# EAGLE design node-lite (EAGLE 8.3.2)
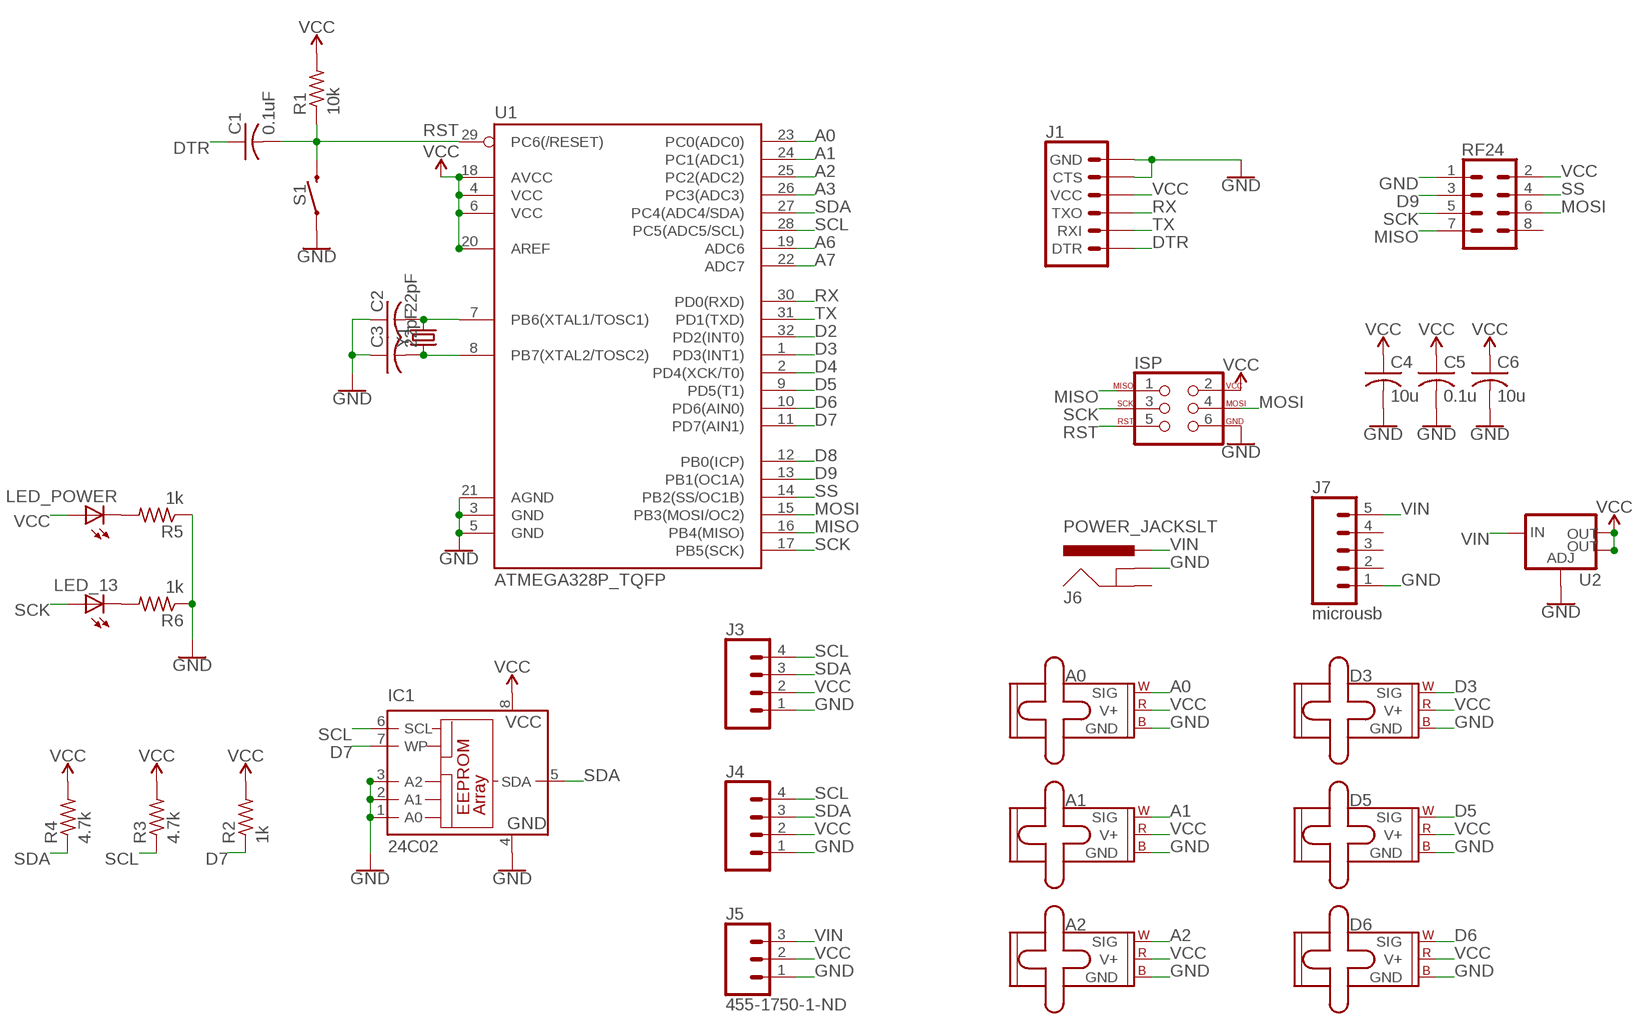
[diagram p0: schematic, sheet 1]

## Parts
A0  SERVO  [1X03]
A1  SERVO  [1X03]
A2  SERVO  [1X03]
C1  0.1uF  C-USC1206  [C1206]
C2  22pF  C-USC1206  [C1206]
C3  22pF  C-USC1206  [C1206]
C4  10u  C-USC1206  [C1206]
C5  0.1u  C-USC1206  [C1206]
C6  10u  C-USC1206  [C1206]
D3  SERVO  [1X03]
D5  SERVO  [1X03]
D6  SERVO  [1X03]
IC1  24C02  24C02ASN  [SO-08]
ISP  AVR_SPI_PROG_3X2NS  [2X3-NS]
J1  6_PIN_SERIAL_TARGET  [1X06]
J3  CONN_04  [1X04]
J4  CONN_04  [1X04]
J5  455-1750-1-ND  CONN_03  [1X03]
J6  POWER_JACKSLT  [POWER_JACK_SLOT]
J7  microusb  CONN_05  [1X05]
LED_13  LEDCHIPLED_1206  [CHIPLED_1206]
LED_POWER  LEDCHIPLED_1206  [CHIPLED_1206]
R1  10k  R-US_R1206  [R1206]
R2  1k  R-US_R1206  [R1206]
R3  4.7k  R-US_R1206  [R1206]
R4  4.7k  R-US_R1206  [R1206]
R5  1k  R-US_R1206  [R1206]
R6  1k  R-US_R1206  [R1206]
RF24  CONN_04X2  [2X4]
S1  MOMENTARY-SWITCH-SPST-PTH-6.0MM  [TACTILE_SWITCH_PTH_6.0MM]
U1  ATMEGA328P_TQFP  [TQFP32-08]
U2  V_REG_LM1117SOT223  [SOT223]
Y1  CRYSTALPTH-HC49US  [HC49US]

## Nets
A0: A0.1(SIG) U1.23(PC0(ADC0))
A1: A1.1(SIG) U1.24(PC1(ADC1))
A2: A2.1(SIG) U1.25(PC2(ADC2))
A3: U1.26(PC3(ADC3))
A6: U1.19(ADC6)
A7: U1.22(ADC7)
D2: U1.32(PD2(INT0))
D3: D3.1(SIG) U1.1(PD3(INT1))
D4: U1.2(PD4(XCK/T0))
D5: D5.1(SIG) U1.9(PD5(T1))
D6: D6.1(SIG) U1.10(PD6(AIN0))
D7: IC1.7(WP) R2.1 U1.11(PD7(AIN1))
D8: U1.12(PB0(ICP))
D9: RF24.3 U1.13(PB1(OC1A))
DTR: C1.1 J1.1(DTR)
GND: A0.3(GND) A1.3(GND) A2.3(GND) C2.1 C3.1 C4.2 C5.2 C6.2 D3.3(GND) D5.3(GND) D6.3(GND) IC1.1(A0) IC1.2(A1) IC1.3(A2) IC1.4(GND) ISP.6 J1.5(CTS) J1.6(GND) J3.1 J4.1 J5.1 J6.GND@1(GNDBREAK) J7.1 R5.1 R6.1 RF24.1 S1.1 U1.3(GND) U1.5(GND) U1.21(AGND) U2.1(ADJ)
MISO: ISP.1 RF24.7 U1.16(PB4(MISO))
MOSI: ISP.4 RF24.6 U1.15(PB3(MOSI/OC2))
N$1: C2.2 U1.7(PB6(XTAL1/TOSC1)) Y1.2
N$2: C3.2 U1.8(PB7(XTAL2/TOSC2)) Y1.1
N$4: LED_POWER.C R5.2
N$5: LED_13.C R6.2
RST: C1.2 ISP.5 R1.1 S1.3 U1.29(PC6(/RESET))
RX: J1.3(TXO) U1.30(PD0(RXD))
SCK: ISP.3 LED_13.A RF24.5 U1.17(PB5(SCK))
SCL: IC1.6(SCL) J3.4 J4.4 R3.1 U1.28(PC5(ADC5/SCL))
SDA: IC1.5(SDA) J3.3 J4.3 R4.1 U1.27(PC4(ADC4/SDA))
SS: RF24.4 U1.14(PB2(SS/OC1B))
TX: J1.2(RXI) U1.31(PD1(TXD))
VCC: A0.2(V+) A1.2(V+) A2.2(V+) C4.1 C5.1 C6.1 D3.2(V+) D5.2(V+) D6.2(V+) IC1.8(VCC) ISP.2 J1.4(VCC) J3.2 J4.2 J5.2 LED_POWER.A R1.2 R2.2 R3.2 R4.2 RF24.2 U1.4(VCC) U1.6(VCC) U1.18(AVCC) U1.20(AREF) U2.2(OUT) U2.4(OUT)
VIN: J5.3 J6.PWR J7.5 U2.3(IN)
Unconnected: J6.GND@2(GND) J7.2 J7.3 J7.4 RF24.8

## Library data of the parts
A0 A1 A2 D3 D5 D6 = SparkFun-Electromechanical:SERVO: Servo Motor 3-pin connector for a standard servo motor (voltage supply, ground, and control signal.) SparkFun Products Servo - Generic (Sub-Micro Size) <https://www.sparkfun.com/products/9065> (ROB-09065) Servo - Generic High Torque Continuous Rotation (Standard Size) <https://www.sparkfun.com/products/9347> (ROB-09347) Servo - Generic High Torque (Standard Size) <https://www.sparkfun.com/products/11965> (ROB-11965)
C1-C6 = resistor:C-US: CAPACITOR, American symbol
IC1 = microchip:24C*: Serial EEPROM 1 K/2 K/4 K; OC_FARNELL: unknown; OC_NEWARK: unknown
ISP = SparkFun-Connectors:AVR_SPI_PROG_3X2: AVR ISP 6 Pin This is the reduced ISP connector for AVR programming. Common on Arduino. This footprint will take up less PCB space and can be used with a 10-pin to 6-pin adapter such as SKU: BOB-08508 **Special note about "TEST_POINT" package. The stop mask is on the top side, so if you want your programming test points to be on the bottom of your board, make sure to place this package on the bottom side of the board. This also ensure that the orientation to program from the bottom side will be correct. SparkFun Products: SparkFun ISP Pogo Adapter <https://www.sparkfun.com/products/11591> - NS Tiny AVR Programmer <https://www.sparkfun.com/products/11801> -PTH
J1 = SparkFun-Connectors:6_PIN_SERIAL_TARGET: 6-pin header connection for use with the "FTDI BASIC" pinout - TARGET SIDE. Also known as "Arduino Serial Program Header". It is used to mate with our FTDI Basic serial programmers using the Arduino IDE. Note, this device has "TARGET" in the name. It is intended to be used on a design that contains a target micro-controller that you wish to program. The "sister" device, named "CABLE" is inteneded to be used on a design that usually lives on the end of your USB cable and prvides the converter chip (FTDI232 or FTDI231x) to commnicate serial RX/TX. You can populate with some of these: Break Away Headers - Straight <https://www.sparkfun.com/products/116> (PRT-00116) For reference (or to suit your programming needs) check out these designs: SparkFun FTDI Basic Breakout - 5V <https://www.sparkfun.com/products/9716> (DEV-09716) SparkFun FTDI Basic Breakout - 3.3V <https://www.sparkfun.com/products/9873> (DEV-09873) SparkFun FTDI SmartBasic <https://www.sparkfun.com/products/12935> (DEV-12935) SparkFun Beefy 3 - FTDI Basic Breakout <https://www.sparkfun.com/products/13746> (DEV-13746)
J3 J4 = SparkFun-Connectors:CONN_04: Multi connection point. Often used as Generic Header-pin footprint for 0.1 inch spaced/style header connections On any of the 0.1 inch spaced packages, you can populate with these: Break Away Headers - Straight <https://www.sparkfun.com/products/116> (PRT-00116) Break Away Male Headers - Right Angle <https://www.sparkfun.com/products/553> (PRT-00553) Female Headers <https://www.sparkfun.com/products/115> (PRT-00115) Break Away Headers - Machine Pin <https://www.sparkfun.com/products/117> (PRT-00117) Break Away Female Headers - Swiss Machine Pin <https://www.sparkfun.com/products/743> (PRT-00743) For SCREWTERMINALS and SPRING TERMINALS visit here: Screw Terimnals on SparkFun.com <https://www.sparkfun.com/search/results?term=Screw+Terminals> (5mm/3.5mm/2.54mm spacing) This device is also useful as a general connection point to wire up your design to another part of your project. Our various solder wires solder well into these plated through hole pads. Hook-Up Wire - Assortment (Stranded, 22 AWG) <https://www.sparkfun.com/products/11375> (PRT-11375) Hook-Up Wire - Assortment (Solid Core, 22 AWG) <https://www.sparkfun.com/products/11367> (PRT-11367) View the entire wire category on our website here <https://www.sparkfun.com/categories/141> Special notes: Molex polarized connector foot print use with SKU : PRT-08231 with associated crimp pins and housings. 1MM SMD Version SKU: PRT-10208; PROD_ID: CONN-09696
J5 = SparkFun-Connectors:CONN_03: Multi connection point. Often used as Generic Header-pin footprint for 0.1 inch spaced/style header connections On any of the 0.1 inch spaced packages, you can populate with these: Break Away Headers - Straight <https://www.sparkfun.com/products/116> (PRT-00116) Break Away Male Headers - Right Angle <https://www.sparkfun.com/products/553> (PRT-00553) Female Headers <https://www.sparkfun.com/products/115> (PRT-00115) Break Away Headers - Machine Pin <https://www.sparkfun.com/products/117> (PRT-00117) Break Away Female Headers - Swiss Machine Pin <https://www.sparkfun.com/products/743> (PRT-00743) Stackable Header - 3 Pin (Female, 0.1") <https://www.sparkfun.com/products/13875> (PRT-13875) For SCREWTERMINALS and SPRING TERMINALS visit here: Screw Terimnals on SparkFun.com <https://www.sparkfun.com/search/results?term=Screw+Terminals> (5mm/3.5mm/2.54mm spacing) This device is also useful as a general connection point to wire up your design to another part of your project. Our various solder wires solder well into these plated through hole pads. Hook-Up Wire - Assortment (Stranded, 22 AWG) <https://www.sparkfun.com/products/11375> (PRT-11375) Hook-Up Wire - Assortment (Solid Core, 22 AWG) <https://www.sparkfun.com/products/11367> (PRT-11367) View the entire wire category on our website here <https://www.sparkfun.com/categories/141> Special notes: Molex polarized connector foot print use with SKU : PRT-08232 with associated crimp pins and housings.; PROD_ID: XXX-00000
J6 = SparkFun-Connectors:POWER_JACK: Power Jack Connector This is the standard 5.5mm barrel jack for power. The PTH is the most common, proven, reliable, footprint. The Slot footprint only works if the mill layer is transmitted to the PCB fab house so be warned. Here are the connectors we sell at SparkFun: DC Barrel Power Jack/Connector <https://www.sparkfun.com/products/119> (PRT-00119) DC Barrel Power Jack/Connector (SMD) <https://www.sparkfun.com/products/12748> (PRT-12748) DC Barrel Jack Adapter - Breadboard Compatible <https://www.sparkfun.com/products/10811> (PRT-10811) It is used on this SparkFun product (and many, many others): SparkFun RedBoard - Programmed with Arduino <https://www.sparkfun.com/products/12757> (DEV-12757) Also, if you need a mating power supply or connector, please check these out: Wall Adapter Power Supply - 9VDC 650mA <https://www.sparkfun.com/products/298> (TOL-00298) DC Barrel Jack Adapter - Male <https://www.sparkfun.com/products/10287> (PRT-10287); PROD_ID: PRT-00119
J7 = SparkFun-Connectors:CONN_05: Multi connection point. Often used as Generic Header-pin footprint for 0.1 inch spaced/style header connections On any of the 0.1 inch spaced packages, you can populate with these: Break Away Headers - Straight <https://www.sparkfun.com/products/116> (PRT-00116) Break Away Male Headers - Right Angle <https://www.sparkfun.com/products/553> (PRT-00553) Female Headers <https://www.sparkfun.com/products/115> (PRT-00115) Break Away Headers - Machine Pin <https://www.sparkfun.com/products/117> (PRT-00117) Break Away Female Headers - Swiss Machine Pin <https://www.sparkfun.com/products/743> (PRT-00743) For SCREWTERMINALS and SPRING TERMINALS visit here: Screw Terimnals on SparkFun.com <https://www.sparkfun.com/search/results?term=Screw+Terminals> (5mm/3.5mm/2.54mm spacing) This device is also useful as a general connection point to wire up your design to another part of your project. Our various solder wires solder well into these plated through hole pads. Hook-Up Wire - Assortment (Stranded, 22 AWG) <https://www.sparkfun.com/products/11375> (PRT-11375) Hook-Up Wire - Assortment (Solid Core, 22 AWG) <https://www.sparkfun.com/products/11367> (PRT-11367) View the entire wire category on our website here <https://www.sparkfun.com/categories/141> Special notes: Molex polarized connector foot print use with SKU : PRT-08231 with associated crimp pins and housings. 1MM SMD Version SKU: PRT-10208
LED_13 LED_POWER = adafruit:LED: LED OSRAM: - CHIPLED LG R971, LG N971, LY N971, LG Q971, LY Q971, LO R971, LY R971 LH N974, LH R974 LS Q976, LO Q976, LY Q976 LO Q996 - Hyper CHIPLED LW Q18S LB Q993, LB Q99A, LB R99A - SideLED LS A670, LO A670, LY A670, LG A670, LP A670 LB A673, LV A673, LT A673, LW A673 LH A674 LY A675 LS A676, LA A676, LO A676, LY A676, LW A676 LS A679, LY A679, LG A679 - Hyper Micro SIDELED® LS Y876, LA Y876, LO Y876, LY Y876 LT Y87S - SmartLED LW L88C, LW L88S LB L89C, LB L89S, LG L890 LS L89K, LO L89K, LY L89K LS L896, LA L896, LO L896, LY L896 - TOPLED LS T670, LO T670, LY T670, LG T670, LP T670 LSG T670, LSP T670, LSY T670, LOP T670, LYG T670 LG T671, LOG T671, LSG T671 LB T673, LV T673, LT T673, LW T673 LH T674 LS T676, LA T676, LO T676, LY T676, LB T676, LH T676, LSB T676, LW T676 LB T67C, LV T67C, LT T67C, LS T67K, LO T67K, LY T67K, LW E67C LS E67B, LA E67B, LO E67B, LY E67B, LB E67C, LV E67C, LT E67C LW T67C LS T679, LY T679, LG T679 LS T770, LO T770, LY T770, LG T770, LP T770 LB T773, LV T773, LT T773, LW T773 LH T774 LS E675, LA E675, LY E675, LS T675 LS T776, LA T776, LO T776, LY T776, LB T776 LHGB T686 LT T68C, LB T68C - Hyper Mini TOPLED® LB M676 - Mini TOPLED Santana® LG M470 LS M47K, LO M47K, LY M47K Source: http://www.osram.convergy.de/
R1-R6 = resistor:R-US_: RESISTOR, American symbol
RF24 = SparkFun-Connectors:CONN_04X2: Multi connection point. Often used as Generic Header-pin footprint for 0.1 inch spaced/style header connections On any of the 0.1 inch spaced packages, you can populate with these: Break Away Headers - Straight <https://www.sparkfun.com/products/116> (PRT-00116) Break Away Male Headers - Right Angle <https://www.sparkfun.com/products/553> (PRT-00553) Female Headers <https://www.sparkfun.com/products/115> (PRT-00115) Break Away Headers - Machine Pin <https://www.sparkfun.com/products/117> (PRT-00117) Break Away Female Headers - Swiss Machine Pin <https://www.sparkfun.com/products/743> (PRT-00743)
S1 = SparkFun-Switches:MOMENTARY-SWITCH-SPST: Momentary Switch (Pushbutton) - SPST Normally-open (NO) SPST momentary switches (buttons, pushbuttons). Variants PTH-12MM - 12mm square, through-hole Momentary Pushbutton Switch - 12mm Square <https://www.sparkfun.com/products/9190> (COM-09190) PTH-6.0MM, PTH-6.0MM-KIT - 6.0mm square, through-hole Mini Pushbutton Switch <https://www.sparkfun.com/products/97> (COM-00097) KIT package intended for soldering kit's - only one side of pads' copper is exposed. PTH-RIGHT-ANGLE-KIT - Right-angle, through-hole Right Angle Tactile Button <https://www.sparkfun.com/products/10791> - Used on SparkFun BigTime Watch Kit <https://www.sparkfun.com/products/11734> SMD-12MM - 12mm square, surface-mount Tactile Button - SMD (12mm) <https://www.sparkfun.com/products/12993> (COM-12993) Used on SparkFun PicoBoard <https://www.sparkfun.com/products/11888> SMD-4.5MM - 4.5mm Square Trackball Switch Used on SparkFun Blackberry Trackballer Breakout <https://www.sparkfun.com/products/13169> SMD-4.6MMX2.8MM - 4.60mm x 2.80mm, surface mount Used on SparkFun SAMD21 Mini Breakout <https://www.sparkfun.com/products/13664> SMD-5.2MM, SMD-5.2-REDUNDANT - 5.2mm square, surface-mount Mini Pushbutton Switch - SMD <https://www.sparkfun.com/products/8720> (COM-08720) Used on Arduino Pro Mini <https://www.sparkfun.com/products/11114> REDUNDANT package connects both switch circuits together SMD-6.0X3.5MM - 6.0 x 3.5mm, surface mount Momentary Reset Switch SMD <https://www.sparkfun.com/products/8229> (COM-08229) SMD-6.2MM-TALL - 6.2mm square, surface mount Tactile Button - SMD (6mm) <https://www.sparkfun.com/products/12992> Used on SparkFun Digital Sandbox <https://www.sparkfun.com/products/12651> SMD-RIGHT-ANGLE - Right-angle, surface mount Used on SparkFun Block for Intel® Edison - Arduino <https://www.sparkfun.com/products/13036>; PROD_ID: SWCH-08441; SF_SKU: COM-00097
U1 = SparkFun-IC-Microcontroller:ATMEGA328P_TQFP: Popular 328P in QFP Storefront component: ATmega328 - TQFP <https://www.sparkfun.com/products/13448> (COM-13448) Datasheet <http://www.sparkfun.com/datasheets/Components/SMD/ATMega328.pdf> SparkFun Products SparkFun RedBoard - Programmed with Arduino <https://www.sparkfun.com/products/12757> (DEV-12757) Arduino Pro Mini 328 - 5V/16MHz <https://www.sparkfun.com/products/11113> (DEV-11113) Arduino Pro Mini 328 - 3.3V/8MHz <https://www.sparkfun.com/products/11114> (DEV-11114) SparkFun OpenLog <https://www.sparkfun.com/products/13712> (DEV-13712) SparkFun MicroView - OLED Arduino Module <https://www.sparkfun.com/products/12923> (DEV-12923) SparkFun Digital Sandbox <https://www.sparkfun.com/products/12651> (DEV-12651) SparkFun PicoBoard <https://www.sparkfun.com/products/11888> (WIG-11888) Arduino Fio <https://www.sparkfun.com/products/10116> (DEV-10116) LilyPad Arduino 328 Main Board <https://www.sparkfun.com/products/13342> (DEV-13342) SparkFun RedStick <https://www.sparkfun.com/products/13741> (DEV-13741) LilyPad MP3 <https://www.sparkfun.com/products/11013> (DEV-11013) LilyPad Arduino SimpleSnap <https://www.sparkfun.com/products/10941> (DEV-10941) SparkFun Stepoko <https://www.sparkfun.com/products/13899> (ROB-13899) SparkFun Geiger Counter <https://www.sparkfun.com/products/11345> (SEN-11345) SparkFun EL Sequencer <https://www.sparkfun.com/products/12781> (COM-12781) Arduino Pro 328 - 5V/16MHz <https://www.sparkfun.com/products/10915> (DEV-10915) CryptoCape <https://www.sparkfun.com/products/12773> (DEV-12773) SparkFun IR Thermometer Evaluation Board - MLX90614 <https://www.sparkfun.com/products/10740> (SEN-10740) SparkFun RedBot Mainboard <https://www.sparkfun.com/products/12097> (ROB-12097) Arduino Pro 328 - 3.3V/8MHz <https://www.sparkfun.com/products/10914> (DEV-10914) SparkFun Block for Intel® Edison - Arduino <https://www.sparkfun.com/products/13036> (DEV-13036) SparkFun Simon Says - Surface Mount Soldering Kit <https://www.sparkfun.com/products/10935> (KIT-10935) SparkFun 7-Segment Serial Display - Red <https://www.sparkfun.com/products/11441> (COM-11441) SparkFun 7-Segment Serial Display - White <https://www.sparkfun.com/products/11629> (COM-11629) SparkFun 7-Segment Serial Display - Yellow <https://www.sparkfun.com/products/11443> (COM-11443) SparkFun 7-Segment Serial Display - Kelly Green <https://www.sparkfun.com/products/11440> (COM-11440) SparkFun 7-Segment Serial Display - Blue <https://www.sparkfun.com/products/11442> (COM-11442) SparkFun OpenSegment Serial Display - 20mm (Blue) <https://www.sparkfun.com/products/11647> (COM-11647) SparkFun OpenSegment Serial Display - 20mm (Green) <https://www.sparkfun.com/products/11646> (COM-11646) SparkFun OpenSegment Serial Display - 20mm (White) <https://www.sparkfun.com/products/11648> (COM-11648) SparkFun OpenSegment Serial Display - 20mm (Red) <https://www.sparkfun.com/products/11644> (COM-11644) SparkFun OpenSegment Serial Display - 20mm (Yellow) <https://www.sparkfun.com/products/11645> (COM-11645) SparkFun OpenSegment Shield <https://www.sparkfun.com/products/13190> (DEV-13190); PROD_ID: IC-09069
U2 = SparkFun-IC-Power:V_REG_LM1117: Voltage Regulator LM1117 Standard adjustable voltage regulator but in SMD form. Spark Fun Electronics SKU : COM-00595; PROD_ID: VREG-08170
Y1 = SparkFun-Clocks:CRYSTAL: Crystals (Generic) These are passive quartz crystals, which can be used as a clock source for a microcontroller. Crystal's are two-terminal devices. They require external "load" capacitors to generate an oscillating signal.

## Board
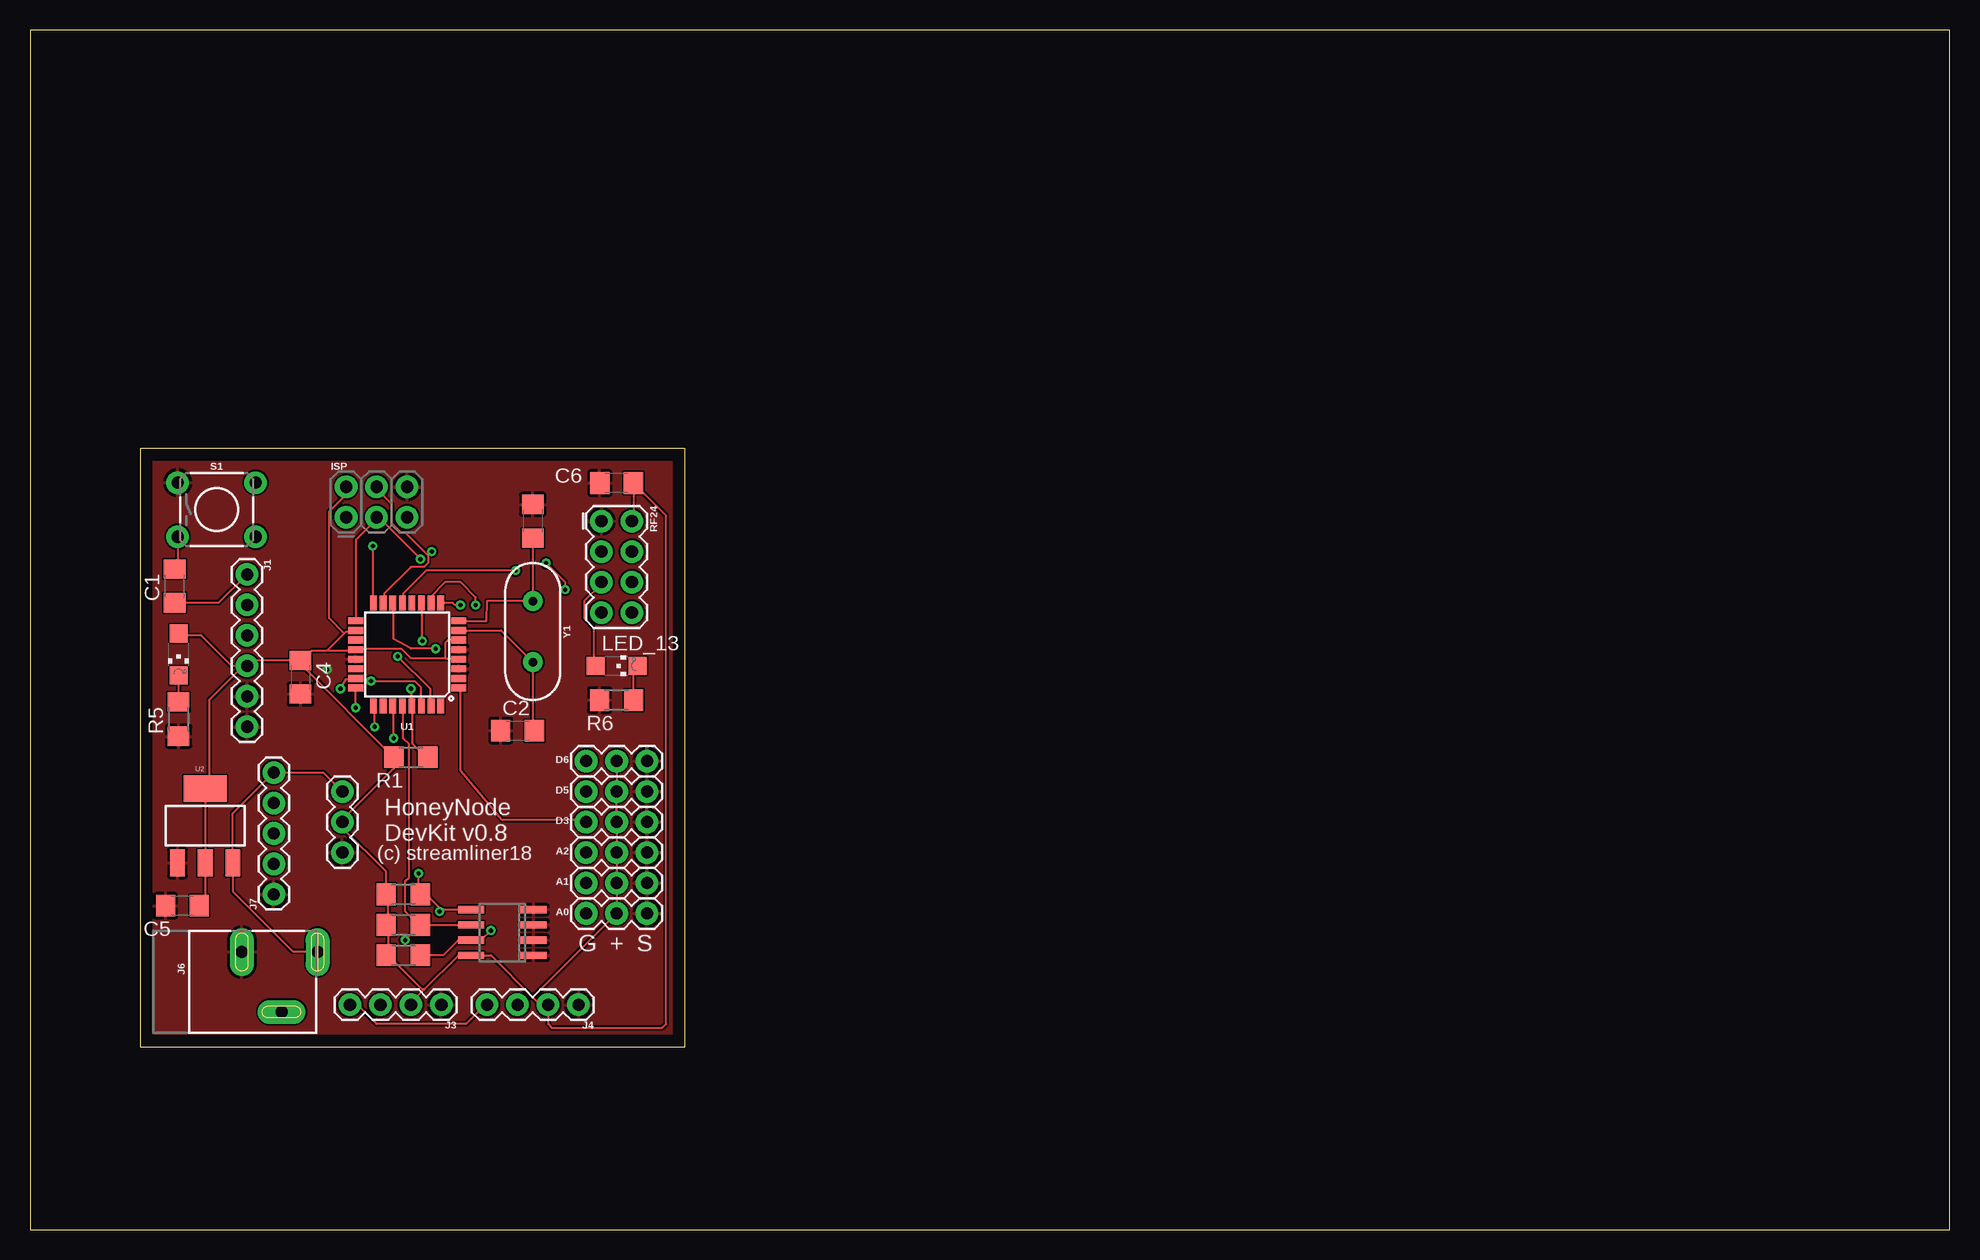
[diagram p1: board, top side]
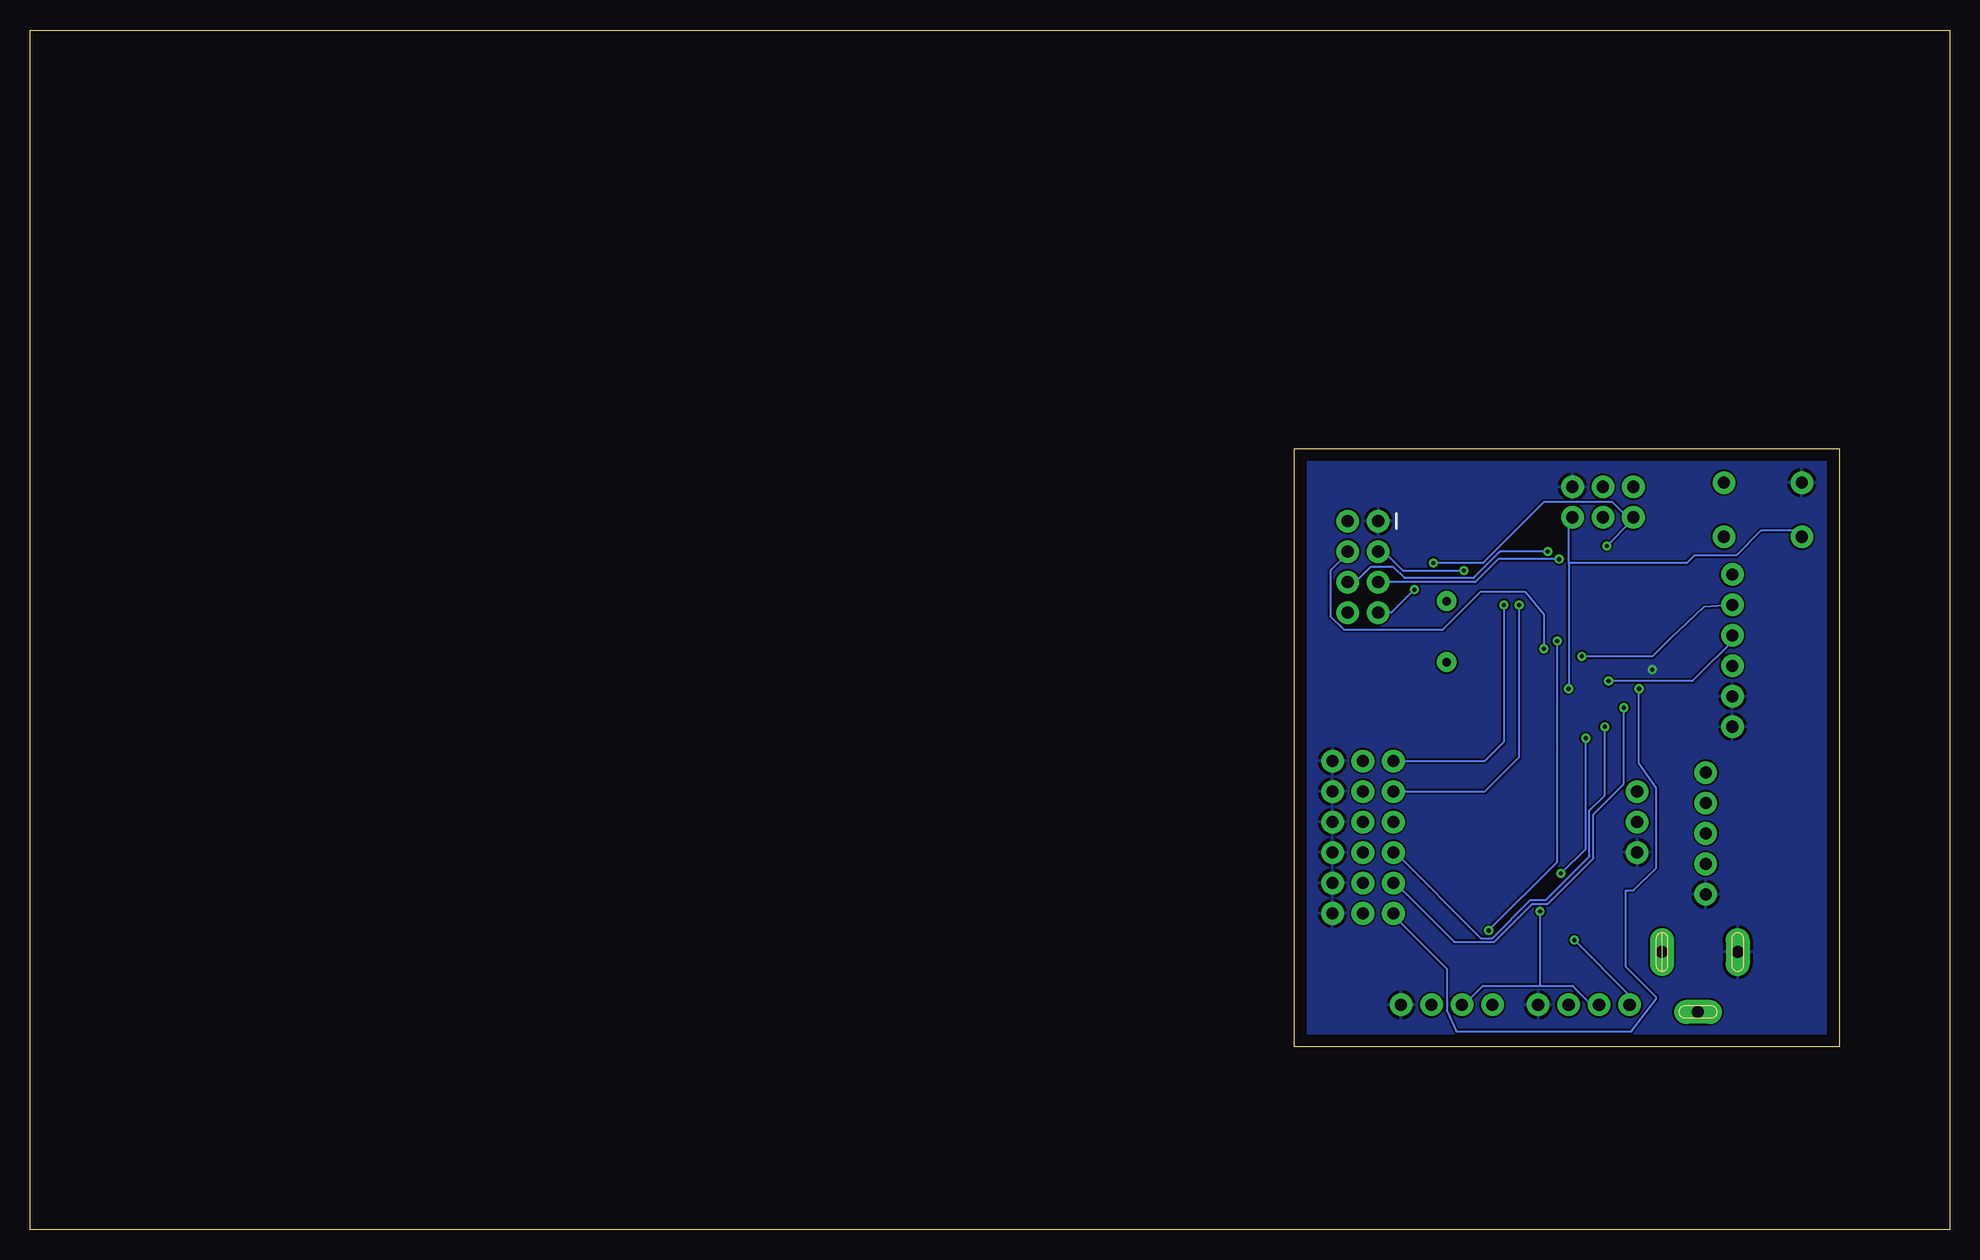
[diagram p2: board, bottom side, seen from below]

Size 160 x 100 mm. Coordinates in mm from the lower left corner, seen from the top.
Outline: 0,0 160,0 160,100 0,100 0,0
Outline: 9.21,65.09 9.21,15.24 54.61,15.24 54.61,65.09 9.21,65.09
Copper layers (1*16): Top 0.035mm / dielectric 1.5mm / Bottom 0.035mm
Design rules "default": minimum track width 6mil, minimum drill 0.35mm, track to track 6mil, track to pad 6mil, pad to pad 6mil, via to via 6mil, smd to smd 6mil, copper to edge 40mil, drill to drill 6mil, minimum pad ring 10mil, minimum via ring 8mil, stop-mask expansion 4mil, vias tented up to drill 0mil, thermal gap 10mil

### Footprints (pad centres in the part's own frame; a part is rotated, then mirrored left to right if it is on the bottom)
1X03 = drill 1.016 pad 1.88: 1 0,0; 2 2.54,0; 3 5.08,0
C1206 = smd 1.6 x 1.8: 1 -1.4,0; 2 1.4,0
SO-08 = smd 0.6 x 2.2: 1 -1.905,-2.6; 2 -0.635,-2.6; 3 0.635,-2.6; 4 1.905,-2.6; 5 1.905,2.6; 6 0.635,2.6; 7 -0.635,2.6; 8 -1.905,2.6
2X3-NS = drill 1.016 pad 1.88: 1 -2.54,-1.27; 2 -2.54,1.27; 3 0,-1.27; 4 0,1.27; 5 2.54,-1.27; 6 2.54,1.27
1X06 = drill 1.016 pad 1.88: 1 0,0; 2 2.54,0; 3 5.08,0; 4 7.62,0; 5 10.16,0; 6 12.7,0
1X04 = drill 1.016 pad 1.88: 1 0,0; 2 2.54,0; 3 5.08,0; 4 7.62,0
POWER_JACK_SLOT = drill 1 pad 2 long: GND@1 2.58,7.5; GND@2 7.58,10.8; PWR 2.58,13.8
1X05 = drill 1.016 pad 1.88: 1 0,0; 2 2.54,0; 3 5.08,0; 4 7.62,0; 5 10.16,0
CHIPLED_1206 = smd 1.5 x 1.5: A 0,-1.75; C 0,1.75
R1206 = smd 1.6 x 1.803: 1 -1.422,0; 2 1.422,0
2X4 = drill 1.016 pad 1.88: 1 -3.81,-1.27; 2 -3.81,1.27; 3 -1.27,-1.27; 4 -1.27,1.27; 5 1.27,-1.27; 6 1.27,1.27; 7 3.81,-1.27; 8 3.81,1.27
TACTILE_SWITCH_PTH_6.0MM = drill 1.016 pad 1.88: 1 -3.251,2.261; 2 3.251,2.261; 3 -3.251,-2.261; 4 3.251,-2.261
TQFP32-08 = smd 1.27 x 0.559: 1 -4.293,2.8; 2 -4.293,2; 3 -4.293,1.2; 4 -4.293,0.4; 5 -4.293,-0.4; 6 -4.293,-1.2; 7 -4.293,-2; 8 -4.293,-2.8; 17 4.293,-2.8; 18 4.293,-2; 19 4.293,-1.2; 20 4.293,-0.4; 21 4.293,0.4; 22 4.293,1.2; 23 4.293,2; 24 4.293,2.8 | smd 0.559 x 1.27: 9 -2.8,-4.293; 10 -2,-4.293; 11 -1.2,-4.293; 12 -0.4,-4.293; 13 0.4,-4.293; 14 1.2,-4.293; 15 2,-4.293; 16 2.8,-4.293; 25 2.8,4.293; 26 2,4.293; 27 1.2,4.293; 28 0.4,4.293; 29 -0.4,4.293; 30 -1.2,4.293; 31 -2,4.293; 32 -2.8,4.293
SOT223 = smd 1.219 x 2.235: 1 -2.311,-3.099; 2 0,-3.099; 3 2.311,-3.099 | smd 3.6 x 2.2: 4 0,3.099
HC49US = drill 0.7 pad 1.651: 1 -2.54,0; 2 2.54,0

### Placement (x,y rotation side)
A0  46.35,26.35 0 top
A1  46.35,28.89 0 top
A2  46.35,31.43 0 top
C1  12.06,53.66 90 top
C2  40.64,41.59 0 top
C3  41.91,59.05 270 top
C4  22.54,46.04 270 top
C5  12.7,26.99 180 top
C6  48.9,62.23 180 top
D3  46.35,33.97 0 top
D5  46.35,36.51 0 top
D6  46.35,39.05 0 top
IC1  39.37,24.77 90 top
ISP  28.89,60.64 0 top
J1  18.1,54.61 270 top
J3  34.29,18.73 180 top
J4  45.72,18.73 180 top
J5  26.04,31.43 90 top
J6  10.16,25.72 270 top
J7  20.32,27.94 90 top
LED_13  48.9,46.99 270 top
LED_POWER  12.38,47.94 180 top
R1  31.75,39.37 180 top
R2  31.11,22.86 180 top
R3  31.11,25.4 180 top
R4  31.11,27.94 180 top
R5  12.38,42.55 90 top
R6  48.9,44.13 0 top
RF24  48.9,55.24 270 top
S1  15.56,60.01 0 top
U1  31.43,47.94 180 top
U2  14.61,33.66 0 top
Y1  41.91,49.85 270 top

### Tracks (layer width: path | path; a pad name or v marks a point on that pad's centre or on a via)
A0  (via drill 0.35)
  Top 0.152: v25.88,45.09 26.35,45.88 26.99,45.88 U1.23
  Bottom 0.152: v25.88,45.09 25.88,38.89 24.45,36.83 24.45,30.16 26.35,28.26 26.99,28.26 26.99,21.91 24.45,19.37 24.45,19.21 26.51,16.51 41.12,16.51 41.91,18.26 41.91,21.75 46.35,26.19 A0.1
A1  (via drill 0.35)
  Top 0.152: v27.15,43.5 27.15,45.09 U1.24
  Bottom 0.152: v27.15,43.5 27.15,37.15 29.69,34.61 29.69,30.96 33.5,27.15 34.77,27.15 37.94,23.97 41.27,23.97 46.2,28.89 A1.1
A2  (via drill 0.35)
  Top 0.152: v28.73,41.91 28.73,43.5 U1.25
  Bottom 0.152: v28.73,41.91 28.73,36.2 30,34.92 30,31.11 33.66,27.46 34.92,27.46 38.1,24.29 39.05,24.29 46.2,31.43 A2.1
D3
  Top 0.152: D3.1 46.2,34.13 39.37,34.13 35.88,38.26 35.88,45.09 U1.1
D5  (via drill 0.35)
  Top 0.152: 35.24,52.23 U1.9 | 35.24,52.23 35.27,52.23 | v35.88,52.07 35.41,52.07 35.24,52.23
  Bottom 0.152: v35.88,52.07 35.88,39.37 38.73,36.51 D5.1
D6  (via drill 0.35)
  Top 0.152: v37.15,52.07 37.15,52.7 35.88,53.98 34.61,53.98 33.34,52.7 33.34,52.33 U1.10
  Bottom 0.152: v37.15,52.07 37.15,40.64 38.73,39.05 D6.1
D7  (via drill 0.35)
  Top 0.152: v32.7,49.05 32.7,52.23 U1.11 | v38.42,24.92 37.62,24.13 IC1.7 35.72,24.13 34.45,22.86 R2.1
  Bottom 0.152: v32.7,49.05 32.7,30.64 v38.42,24.92
D9  (via drill 0.35)
  Top 0.152: v40.48,54.93 33.02,54.93 31.11,53.02 31.11,52.39 U1.13
  Bottom 0.152: v40.48,54.93 45.56,54.93 47.15,56.52 RF24.3
DTR
  Top 0.152: C1.1 15.74,52.26 J1.1
GND  (via drill 0.35)
  other vias: 24.77,46.67
  pour Top: 6.35,13.97 6.35,68.58 57.15,68.58 57.15,13.97
  pour Bottom: 3.81,71.12 3.81,11.43 59.69,11.43 59.69,71.12
MISO  (via drill 0.35)
  Top 0.152: v28.57,56.99 28.57,52.39 U1.16 | v44.61,53.34 44.61,53.98 v43.02,55.56
  Bottom 0.152: 26.51,59.05 26.35,59.21 ISP.1 26.51,59.05 | 26.51,59.05 v28.57,56.99 | RF24.7 46.51,51.44 v44.61,53.34 | v43.02,55.56 38.89,55.56 33.81,60.64 28.1,60.64 26.51,59.05
MOSI  (via drill 0.35)
  Top 0.152: 33.18,56.2 33.18,55.56 32.86,55.24 31.75,55.24 29.53,53.02 29.53,52.39 U1.15 | 33.18,56.2 31.27,58.1 30.96,58.1 30.16,58.9 30.16,60.48 28.89,61.75 ISP.4 | 33.18,56.2 v33.5,56.52
  Bottom 0.152: RF24.6 49.53,53.98 48.26,55.24 46.35,55.24 45.4,54.29 39.69,54.29 37.47,56.52 v33.5,56.52
N$1
  Top 0.152: C2.2 41.91,41.59 Y1.2 39.27,49.94 U1.7
N$2
  Top 0.152: U1.8 38.04,50.74 38.1,52.39 Y1.1 C3.2
N$4
  Top 0.152: R5.2 LED_POWER.C
N$5
  Top 0.152: R6.2 50.32,46.66 LED_13.C
RST  (via drill 0.35)
  Top 0.152: R1.1 33.02,39.37 31.91,40.48 31.91,43.5 U1.29 31.75,43.66 v31.75,45.09 | S1.3 12.31,55.3 C1.2
  Bottom 0.152: 31.75,55.56 31.75,59.05 ISP.5 | 31.75,55.56 v31.75,45.09 | S1.3 12.5,58.26 15.72,58.26 17.78,56.2 21.27,56.2 21.91,55.56 31.75,55.56
RX  (via drill 0.35)
  Top 0.152: v28.42,45.72 32.07,45.72 32.54,45.24 32.54,43.66 U1.30
  Bottom 0.152: v28.42,45.72 21.43,45.72 17.62,49.53 J1.3
SCK  (via drill 0.35)
  Top 0.152: RF24.5 47.62,53.82 46.2,52.39 46.2,50.96 46.99,50.16 46.99,47.62 LED_13.A | 28.89,59.21 27.15,57.47 27.15,50.8 U1.17 | v32.54,55.88 29.21,59.21 28.89,59.21 | 28.89,59.21 ISP.3
  Bottom 0.152: RF24.5 39.53,53.98 37.62,55.88 v32.54,55.88
SCL  (via drill 0.35)
  Top 0.152: J3.4 27.3,18.73 28.89,17.14 36.35,17.14 37.94,18.73 J4.4 | U1.28 31.11,43.5 31.11,40.96 31.59,40.48 31.59,29.37 31.27,29.05 31.27,26.51 32.38,25.4 R3.1 | R3.1 IC1.6 | R3.1 v31.27,24.13
  Bottom 0.152: J3.4 26.67,19.53 v31.27,24.13
SDA  (via drill 0.35)
  Top 0.152: v30.32,40.96 30.32,43.5 U1.27 | 32.38,28.57 32.38,27.94 R4.1 32.38,28.57 | 32.38,28.57 v32.38,29.69 | 34.29,26.67 IC1.5 | 32.38,28.57 34.29,26.67 | 34.29,26.67 v34.13,26.51
  Bottom 0.152: J3.3 29.84,18.73 31.43,20.32 34.13,20.32 | 34.13,20.32 38.89,20.32 40.48,18.73 J4.3 | v30.32,40.96 30.32,31.75 v32.38,29.69 | v34.13,26.51 34.13,20.32
SS  (via drill 0.35)
  Top 0.152: v33.81,48.42 31.75,48.42 30.32,49.21 30.32,52.23 U1.14
  Bottom 0.152: v33.81,48.42 33.81,51.28 35.4,53.18 39.05,53.18 42.23,50.01 50.48,50.01 51.59,51.12 51.59,54.93 50.16,56.36 RF24.4
TX  (via drill 0.35)
  Top 0.152: v30.64,47.78 33.34,45.09 33.34,43.66 U1.31
  Bottom 0.152: v30.64,47.78 24.77,47.78 23.18,49.37 20.48,51.91 J1.2
VCC
  Top 0.152: D6.2 D5.2 D3.2 A2.2 A1.2 A0.2 41.91,19.37 | R1.2 30.32,38.42 26.04,34.13 J5.2 26.04,33.5 29.69,29.84 R4.2 29.84,27.94 29.84,25.4 | 29.84,25.4 29.84,22.86 | 29.84,25.4 R3.2 | 32.86,20 31.75,18.89 J3.2 | 32.86,20 35.72,22.86 IC1.8 38.42,22.86 41.91,19.37 | 29.84,22.86 32.7,20 32.86,20 | 29.84,22.86 R2.2 | 41.91,19.37 42.55,18.73 J4.2 43.18,17.14 43.5,16.83 52.7,16.83 53.02,17.14 53.02,59.5 C6.1 50.3,59.19 RF24.2 | 24.77,48.26 23.5,48.26 22.54,47.31 | 24.77,48.26 26.99,48.26 U1.20 27.15,48.42 30.96,48.42 31.75,47.62 34.61,47.62 | 24.77,48.26 26.19,49.69 | 26.19,49.69 26.35,49.85 26.99,49.85 U1.18 | 34.61,47.62 35.72,47.62 U1.4 | ISP.2 26.35,61.28 24.92,59.85 24.92,50.96 26.19,49.69 | 22.54,47.31 22.38,47.15 | 22.38,47.15 22.23,46.99 | 22.54,47.31 C4.1 | R1.2 22.54,47.15 22.38,47.15 | R1.2 | 22.38,47.15 C4.1 | U1.6 34.85,49.14 34.61,48.9 34.61,47.62 | C4.1 18.55,47.44 J1.4 | J1.4 16.83,46.99 14.29,49.53 12.54,49.53 LED_POWER.A | J1.4 17.78,46.99 14.92,44.13 14.92,37.07 U2.4 U2.2 14.61,27.49 C5.1
VIN
  Top 0.152: 16.35,29.53 U2.3 | U2.3 16.92,28.17 21.91,23.18 23.92,23.18 J6.PWR | J5.3 24.45,38.1 J7.5 16.92,34.7 U2.3

### Text on the board
tNames: HoneyNode / DevKit v0.8 | (c) streamliner18 | G + S